# Altium schematic sheet 3V3.SchDoc
size A; SheetNumber: 1; SheetTotal: 1
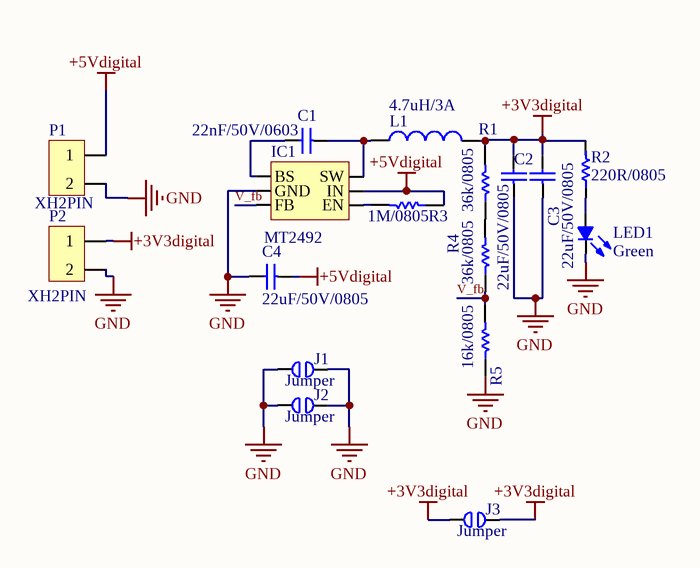
[diagram p0: 3V3.SchDoc]

## Parts
C1  22nF/50V/0603  [cap 0603]
C2  22uF/50V/0805  [CAP 0805]
C3  22uF/50V/0805  [CAP 0805]
C4  22uF/50V/0805  [CAP 0805]
IC1  MT2492  [SOT23-6]
J1  Jumper  [JUMPER 11MM]
J2  Jumper  [JUMPER 11MM]
J3  Jumper  [JUMPER 11MM]
L1  4.7uH/3A  [5030]
LED1  COLOR: Green  [LED 3mm]  (hidden comment: LED 3mm/Green)
P1  XH2PIN  [pin-header 2*1]
P2  XH2PIN  [pin-header 2*1]
R1  36k/0805  [Resistor 0603]
R2  220R/0805  [RES 0805]
R3  1M/0805  [RES 0805]
R4  36k/0805  [Resistor 0603]
R5  16k/0805  [Resistor 0603]

## Nets
+3V3digital: C2.1(+) C3.1(+) J3.1 J3.2 L1.2 P2.1 R1.2 R2.2
+5Vdigital: C4.2(-) IC1.5(IN) P1.1 R3.1
GND: C2.2(-) C3.2(-) C4.1(+) IC1.2(GND) J1.1 J1.2 J2.1 J2.2 LED1.2(K) P1.2 P2.2 R5.1
V_fb: IC1.3(FB) R4.1 R5.2
NetC1_1: C1.1(+) IC1.1(BS)
NetC1_2: C1.2(-) IC1.6(SW) L1.1
NetIC1_4: IC1.4(EN) R3.2
NetLED1_1: LED1.1(A) R2.1
NetR1_1: R1.1 R4.2

## Library data of the parts
C1-C4 = Capacitor
IC1 = ME3116AM6G
L1 = Inductor
LED1 = LED: Typical LED
P1 P2 = Header 2H: RELAY; LatestRevisionDate: 17-Jul-2002; LatestRevisionNote: Re-released for DXP Platform.; Publisher: Altium Limited
R1 R3-R5 = Res1: Resistor; Published: 8-Jun-2000; LatestRevisionDate: 17-Jul-2002; LatestRevisionNote: Re-released for DXP Platform.; PackageReference: AXIAL-0.3; Publisher: Altium Limited; PackageDescription: Axial Device, Thru-Hole; 2 Leads; 0.3 in Pin Spacing
  R1 R4: Value: 36k/0805
  R3: Value: 1M/0805
  R5: Value: 16k/0805
R2 = Res: value: 220R/0805